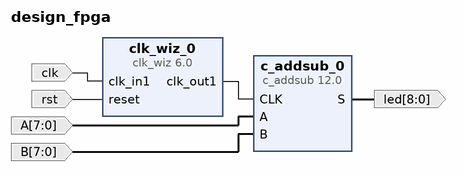
[diagram p0: block diagram of the top level]
# Vivado block design design_fpga, xc7a35tcpg236-2L, Vivado 2023.1
create_bd_design design_fpga

create_bd_port -dir I -from 7 -to 0 -type data A
create_bd_port -dir I -from 7 -to 0 -type data B
create_bd_port -dir O -from 8 -to 0 -type data led
create_bd_port -dir I -type clk clk
set_property -dict {CONFIG.FREQ_HZ 100000000} [get_bd_ports clk]
create_bd_port -dir I -type rst rst
set_property -dict {CONFIG.POLARITY ACTIVE_HIGH} [get_bd_ports rst]

create_bd_cell -type ip -vlnv xilinx.com:ip:c_addsub:12.0 c_addsub_0
set_property -dict [list \
  CONFIG.A_Type Unsigned \
  CONFIG.A_Width 8 \
  CONFIG.B_Type Unsigned \
  CONFIG.B_Value 00000000 \
  CONFIG.B_Width 8 \
  CONFIG.CE false \
  CONFIG.Latency 1 \
  CONFIG.Out_Width 9 \
] [get_bd_cells c_addsub_0]
create_bd_cell -type ip -vlnv xilinx.com:ip:clk_wiz:6.0 clk_wiz_0

# ---- connections ----

connect_bd_net -net A_0_1 [get_bd_ports A] [get_bd_pins c_addsub_0/A]
connect_bd_net -net B_0_1 [get_bd_ports B] [get_bd_pins c_addsub_0/B]
connect_bd_net [get_bd_pins c_addsub_0/S] [get_bd_ports led]
connect_bd_net -net clk_100MHz_1 [get_bd_ports clk] [get_bd_pins clk_wiz_0/clk_in1]
connect_bd_net [get_bd_pins clk_wiz_0/clk_out1] [get_bd_pins c_addsub_0/CLK]
connect_bd_net -net reset_rtl_0_1 [get_bd_ports rst] [get_bd_pins clk_wiz_0/reset]

validate_bd_design
save_bd_design
